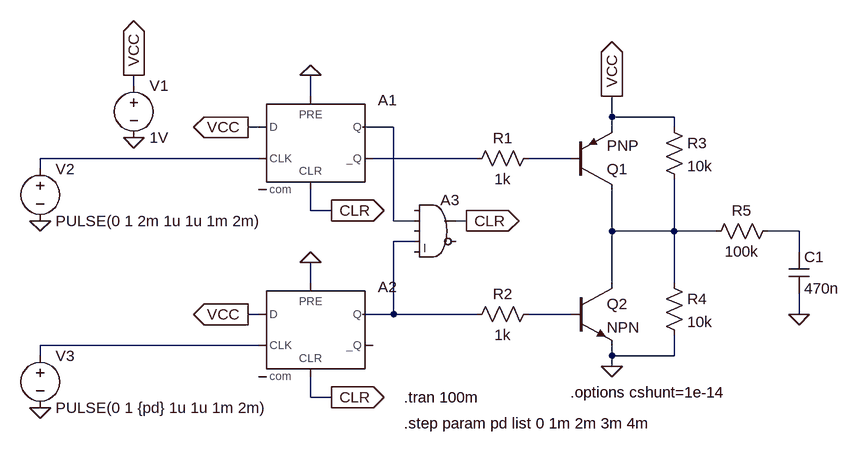
[diagram p0: schematic PLL_PhaseDetector2.asc]
PLL_PhaseDetector2.asc, the LTspice schematic file:
Version 4
SHEET 1 964 680
WIRE -176 32 -176 16
WIRE 96 48 96 16
WIRE 560 80 560 48
WIRE 656 80 560 80
WIRE 16 96 0 96
WIRE 224 96 176 96
WIRE 560 96 560 80
WIRE 656 96 656 80
WIRE 16 144 -320 144
WIRE 352 144 192 144
WIRE 496 144 432 144
WIRE -320 160 -320 144
WIRE 96 224 96 192
WIRE 128 224 96 224
WIRE 224 240 224 96
WIRE 256 240 224 240
WIRE 336 240 320 240
WIRE 560 256 560 192
WIRE 656 256 656 176
WIRE 656 256 560 256
WIRE 720 256 656 256
WIRE 848 256 800 256
WIRE 256 272 224 272
WIRE 848 288 848 256
WIRE 96 336 96 304
WIRE 560 336 560 256
WIRE 656 336 656 256
WIRE 16 384 0 384
WIRE 224 384 224 272
WIRE 224 384 176 384
WIRE 352 384 224 384
WIRE 496 384 432 384
WIRE 848 384 848 352
WIRE 16 432 -320 432
WIRE -320 448 -320 432
WIRE 560 448 560 432
WIRE 656 448 656 416
WIRE 656 448 560 448
WIRE 560 464 560 448
WIRE 96 512 96 480
WIRE 128 512 96 512
FLAG -176 112 0
FLAG -320 240 0
FLAG -320 528 0
FLAG 0 96 VCC
IOPIN 0 96 Out
FLAG 0 384 VCC
IOPIN 0 384 Out
FLAG -176 16 VCC
IOPIN -176 16 Out
FLAG 560 464 0
FLAG 560 48 VCC
IOPIN 560 48 Out
FLAG 128 224 CLR
IOPIN 128 224 Out
FLAG 128 512 CLR
IOPIN 128 512 Out
FLAG 336 240 CLR
IOPIN 336 240 Out
FLAG 848 384 0
FLAG 96 16 0
FLAG 96 304 0
SYMBOL Digital\\dflop 96 48 R0
SYMATTR InstName A1
SYMBOL Digital\\dflop 96 336 R0
SYMATTR InstName A2
SYMBOL voltage -176 16 R0
SYMATTR InstName V1
SYMATTR Value 1V
SYMBOL voltage -320 144 R0
WINDOW 123 0 0 Left 0
WINDOW 39 0 0 Left 0
SYMATTR InstName V2
SYMATTR Value PULSE(0 1 2m 1u 1u 1m 2m)
SYMBOL voltage -320 432 R0
WINDOW 123 0 0 Left 0
WINDOW 39 0 0 Left 0
SYMATTR InstName V3
SYMATTR Value PULSE(0 1 {pd} 1u 1u 1m 2m)
SYMBOL res 448 128 R90
WINDOW 0 0 56 VBottom 2
WINDOW 3 32 56 VTop 2
SYMATTR InstName R1
SYMATTR Value 1k
SYMBOL res 448 368 R90
WINDOW 0 0 56 VBottom 2
WINDOW 3 32 56 VTop 2
SYMATTR InstName R2
SYMATTR Value 1k
SYMBOL res 640 80 R0
SYMATTR InstName R3
SYMATTR Value 10k
SYMBOL res 640 320 R0
SYMATTR InstName R4
SYMATTR Value 10k
SYMBOL pnp 496 192 M180
SYMATTR InstName Q1
SYMBOL npn 496 336 R0
SYMATTR InstName Q2
SYMBOL Digital\\and 288 192 R0
SYMATTR InstName A3
SYMBOL res 816 240 R90
WINDOW 0 0 56 VBottom 2
WINDOW 3 32 56 VTop 2
SYMATTR InstName R5
SYMATTR Value 100k
SYMBOL cap 832 288 R0
SYMATTR InstName C1
SYMATTR Value 470n
TEXT 240 512 Left 2 !.tran 100m
TEXT 240 552 Left 2 !.step param pd list 0 1m 2m 3m 4m
TEXT 496 504 Left 2 !.options cshunt=1e-14

The netlist it stands for:
* PLL_PhaseDetector2.asc
A1 VCC 0 N002 0 CLR N003 N001 0 DFLOP
A2 VCC 0 N009 0 CLR 0 N007 0 DFLOP
V1 VCC 0 1V
V2 N002 0 PULSE(0 1 2m 1u 1u 1m 2m)
V3 N009 0 PULSE(0 1 {pd} 1u 1u 1m 2m)
R1 N004 N003 1k
R2 N008 N007 1k
R3 VCC N005 10k
R4 N005 0 10k
Q1 N005 N004 VCC 0 PNP
Q2 N005 N008 0 0 NPN
A3 0 N001 0 N007 0 0 CLR 0 AND
R5 N006 N005 100k
C1 N006 0 470n
.model NPN NPN
.model PNP PNP
.lib standard.bjt
.tran 100m
.step param pd list 0 1m 2m 3m 4m
.options cshunt=1e-14
.backanno
.end